# EAGLE design ti-an043 (EAGLE 6.4)
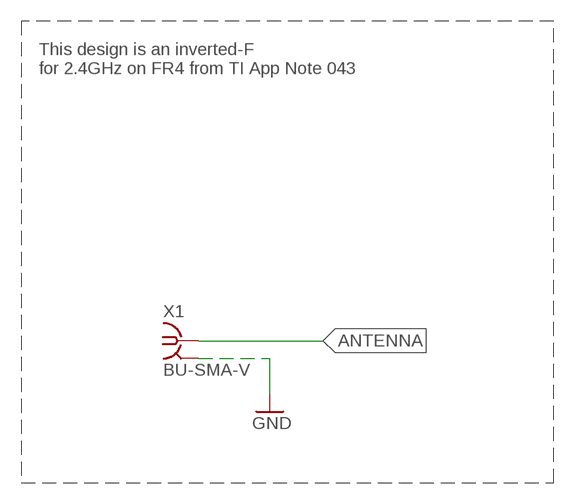
[diagram p0: schematic, sheet 1]

## Parts
X1  BU-SMA-V  [BU-SMA-V]

## Nets
ANTENNA: X1.1
GND: X1.2(GND)

## Notes on the sheet
- This design is an inverted-F 
  for 2.4GHz on FR4 from TI App Note 043

## Power pins joined to a net without a drawn wire
GND: X1.3(GND) X1.4(GND) X1.5(GND)

## Library data of the parts
X1 = con-coax:BU-SMA-V: FEMALE SMA CONNECTOR Radiall distributor RS 112-3794; OC_FARNELL: unknown; OC_NEWARK: unknown

## Board
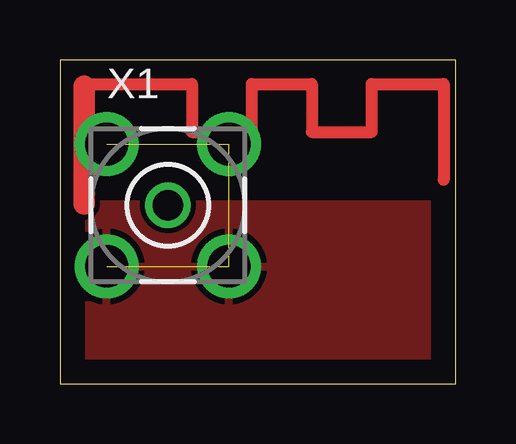
[diagram p1: board, top side]

Size 16.5 x 13.5 mm. Coordinates in mm from the lower left corner, seen from the top.
Outline: 0,0 16.5,0 16.5,13.5 0,13.5 0,0
Copper layers (1*16): Top 0.035mm / dielectric 1.5mm / Bottom 0.035mm
Design rules "default": minimum track width 10mil, minimum drill 24mil, track to track 8mil, track to pad 8mil, pad to pad 8mil, via to via 8mil, smd to smd 8mil, copper to edge 40mil, drill to drill 8mil, minimum pad ring 10mil, minimum via ring 8mil, stop-mask expansion 4mil, vias tented up to drill 0mil, thermal gap 10mil

### Footprints (pad centres in the part's own frame; a part is rotated, then mirrored left to right if it is on the bottom)
BU-SMA-V = drill 1.27: 1 0,0 | drill 1.778: 2 -2.55,2.55; 3 2.55,2.55; 4 2.55,-2.55; 5 -2.55,-2.55

### Placement (x,y rotation side)
X1  4.5,7.44 0 top

### Tracks (layer width: path | path; a pad name or v marks a point on that pad's centre or on a via)
GND  (3 unrouted)
  pour Top: 0,7.5 16.5,7.5 16.5,0 0,0
N$1
  Top 0.9: 1,7.5 1,12.4
N$2
  Top 0.5: 1,12.5 5.5,12.5 5.5,10.5 7.5,10.5 8,10.5 8,12.5 10.5,12.5 10.5,10.5 13,10.5 13,12.5 16,12.5 16,8.5